# EAGLE design eTapper1main21 (EAGLE 8.2.2)
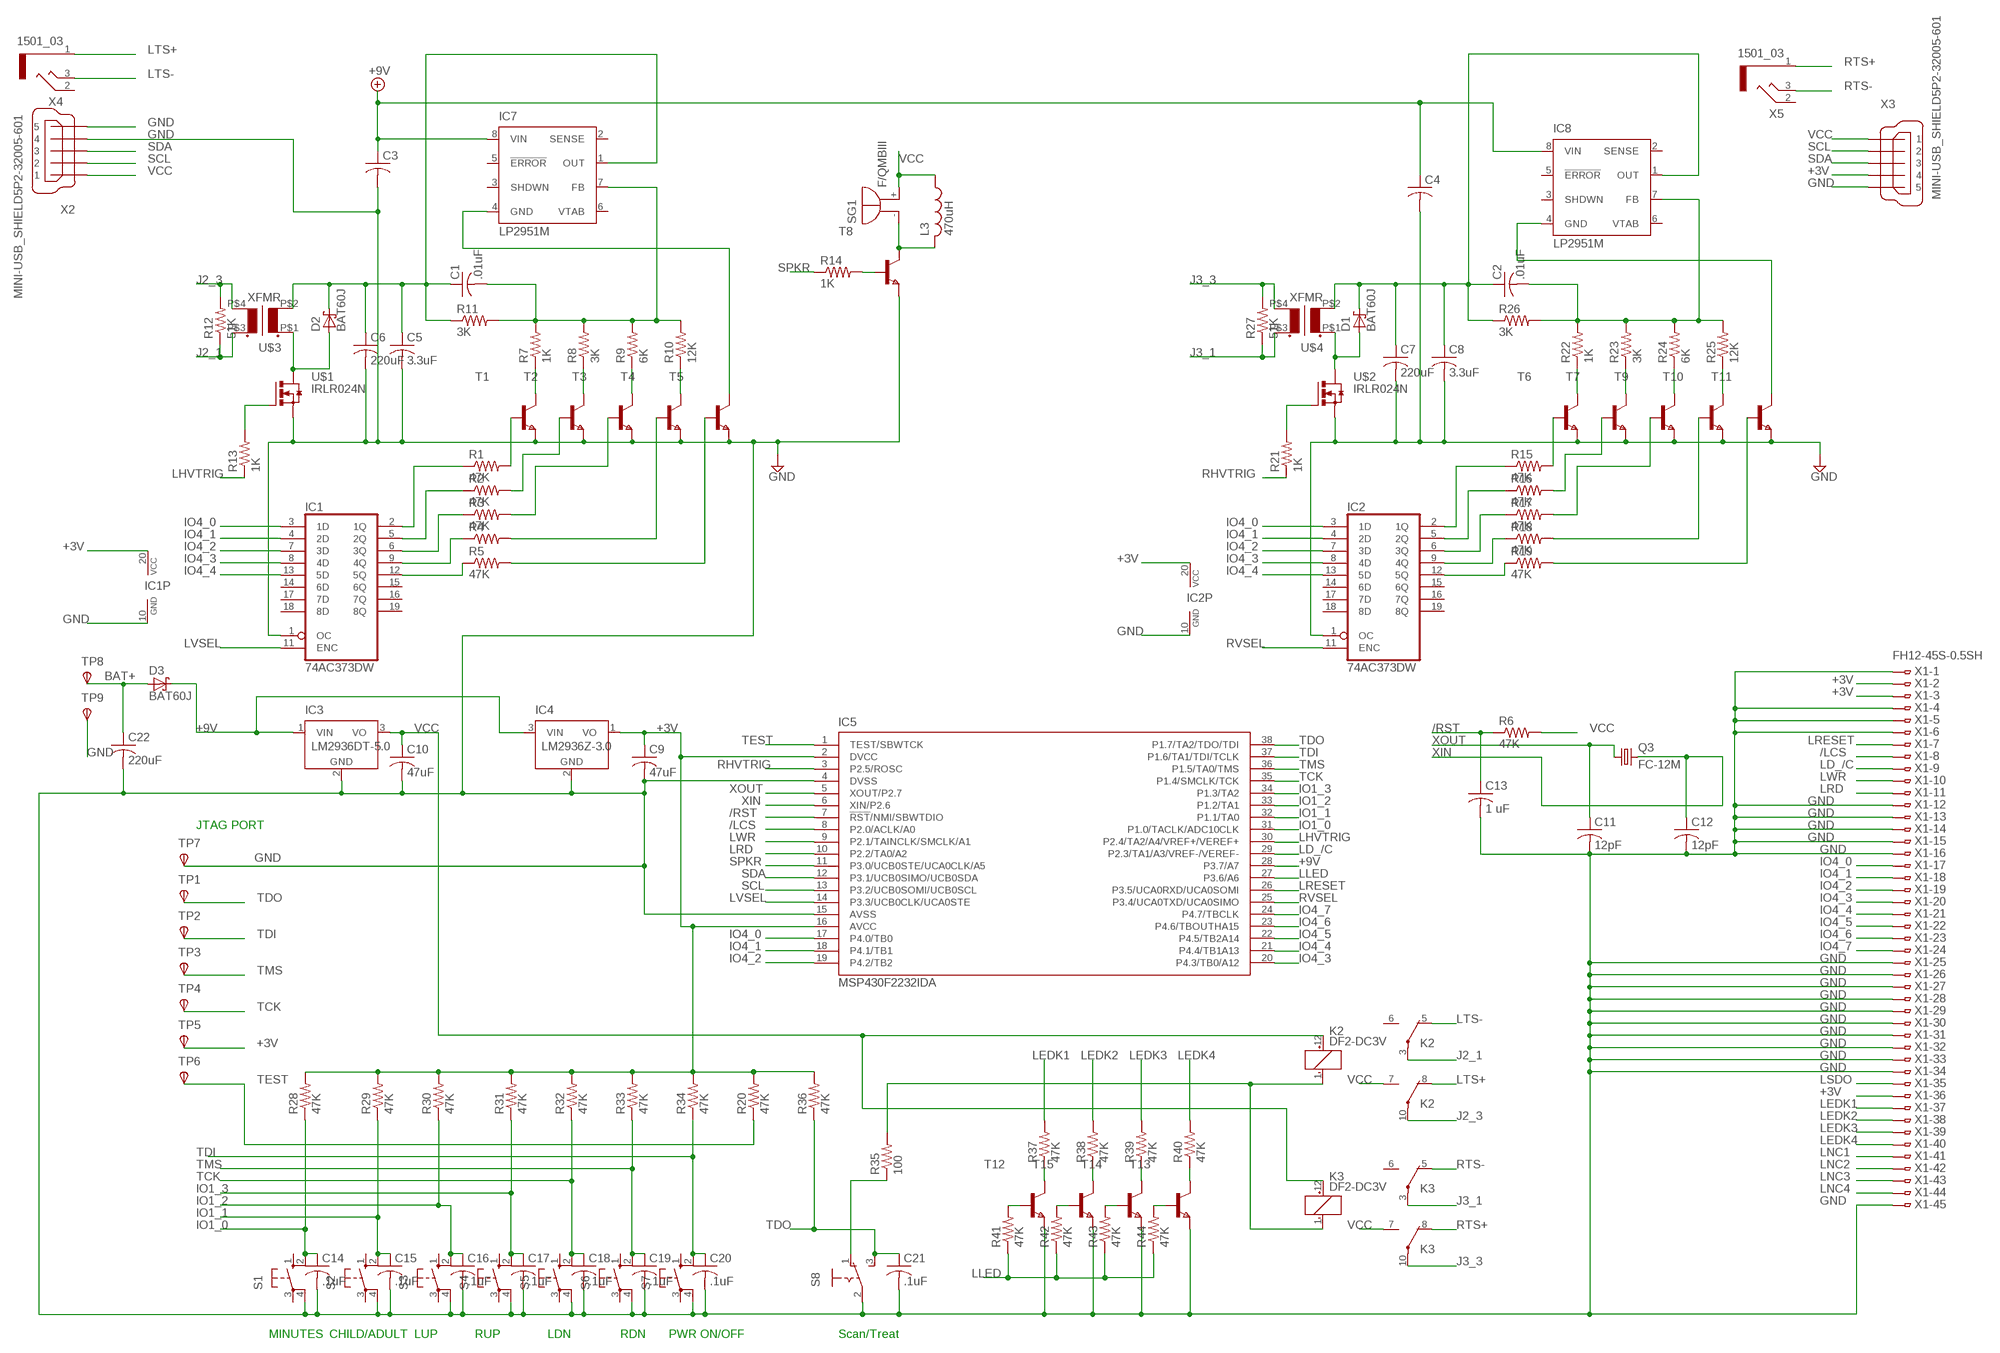
[diagram p0: schematic, sheet 1]

## Parts
C1  .01uF  C-USC0805  [C0805]
C2  .01uF  C-USC0805  [C0805]
C3  C-USC0805  [C0805]
C4  C-USC0805  [C0805]
C5  3.3uF  C-USC0805  [C0805]
C6  220uF  C-USC0805  [C0805]
C7  220uF  C-USC0805  [C0805]
C8  3.3uF  C-USC0805  [C0805]
C9  47uF  C-USC0805  [C0805]
C10  47uF  C-USC0805  [C0805]
C11  12pF  C-USC0805  [C0805]
C12  12pF  C-USC0805  [C0805]
C13  1 uF  C-USC0805  [C0805]
C14  .1uF  C-USC0805  [C0805]
C15  .1uF  C-USC0805  [C0805]
C16  .1uF  C-USC0805  [C0805]
C17  .1uF  C-USC0805  [C0805]
C18  .1uF  C-USC0805  [C0805]
C19  .1uF  C-USC0805  [C0805]
C20  .1uF  C-USC0805  [C0805]
C21  .1uF  C-USC0805  [C0805]
C22  220uF  C-USC0805  [C0805]
D1  BAT60J  [SOD323_ST]
D2  BAT60J  [SOD323_ST]
D3  BAT60J  [SOD323_ST]
IC1  74AC373DW  [SO20W]
IC2  74AC373DW  [SO20W]
IC3  LM2936DT-5.0  [TO252]
IC4  LM2936Z-3.0  [TO92]
IC5  MSP430F2232IDA  [TSSOP38_R-PDSO-G38-DA]
IC7  LP2951M  [SO08]
IC8  LP2951M  [SO08]
K2  DF2-DC3V  [DF2]
K3  DF2-DC3V  [DF2]
L3  470uH  L-USL2825P  [L2825P]
Q3  FC-12M  [FC-12M]
R1  47K  R-US_R0402  [R0402]
R2  47K  R-US_R0402  [R0402]
R3  47K  R-US_R0402  [R0402]
R4  R-US_R0402  [R0402]
R5  47K  R-US_R0402  [R0402]
R6  47K  R-US_R0402  [R0402]
R7  1K  R-US_R0402  [R0402]
R8  3K  R-US_R0402  [R0402]
R9  6K  R-US_R0402  [R0402]
R10  12K  R-US_R0402  [R0402]
R11  3K  R-US_R0402  [R0402]
R12  51K  R-US_R0402  [R0402]
R13  1K  R-US_R0402  [R0402]
R14  1K  R-US_R0402  [R0402]
R15  47K  R-US_R0402  [R0402]
R16  47K  R-US_R0402  [R0402]
R17  47K  R-US_R0402  [R0402]
R18  47K  R-US_R0402  [R0402]
R19  47K  R-US_R0402  [R0402]
R20  47K  R-US_R0402  [R0402]
R21  1K  R-US_R0402  [R0402]
R22  1K  R-US_R0402  [R0402]
R23  3K  R-US_R0402  [R0402]
R24  6K  R-US_R0402  [R0402]
R25  12K  R-US_R0402  [R0402]
R26  3K  R-US_R0402  [R0402]
R27  51K  R-US_R0402  [R0402]
R28  47K  R-US_R0402  [R0402]
R29  47K  R-US_R0402  [R0402]
R30  47K  R-US_R0402  [R0402]
R31  47K  R-US_R0402  [R0402]
R32  47K  R-US_R0402  [R0402]
R33  47K  R-US_R0402  [R0402]
R34  47K  R-US_R0402  [R0402]
R35  100  R-US_R0402  [R0402]
R36  47K  R-US_R0402  [R0402]
R37  47K  R-US_R0402  [R0402]
R38  47K  R-US_R0402  [R0402]
R39  47K  R-US_R0402  [R0402]
R40  47K  R-US_R0402  [R0402]
R41  47K  R-US_R0402  [R0402]
R42  47K  R-US_R0402  [R0402]
R43  47K  R-US_R0402  [R0402]
R44  47K  R-US_R0402  [R0402]
S1  10-XX  [B3F-10XX]
S2  10-XX  [B3F-10XX]
S3  10-XX  [B3F-10XX]
S4  10-XX  [B3F-10XX]
S5  10-XX  [B3F-10XX]
S6  10-XX  [B3F-10XX]
S7  10-XX  [B3F-10XX]
S8  M251  [M251]
SG1  F/QMBIII  [F/QMBIII]
T1  NPNSOT23  [SOT-23]
T2  NPNSOT23  [SOT-23]
T3  NPNSOT23  [SOT-23]
T4  NPNSOT23  [SOT-23]
T5  NPNSOT23  [SOT-23]
T6  NPNSOT23  [SOT-23]
T7  NPNSOT23  [SOT-23]
T8  NPNSOT23  [SOT-23]
T9  NPNSOT23  [SOT-23]
T10  NPNSOT23  [SOT-23]
T11  NPNSOT23  [SOT-23]
T12  NPNSOT23  [SOT-23]
T13  NPNSOT23  [SOT-23]
T14  NPNSOT23  [SOT-23]
T15  NPNSOT23  [SOT-23]
TP1  TPSTP06R  [TP06R]
TP2  TPSTP06R  [TP06R]
TP3  TPSTP06R  [TP06R]
TP4  TPSTP06R  [TP06R]
TP5  TPSTP06R  [TP06R]
TP6  TPSTP06R  [TP06R]
TP7  TPSTP06R  [TP06R]
TP8  TPSTP06R  [TP06R]
TP9  TPSTP06R  [TP06R]
U$1  IRLR024N  [I-PAK_TO251AA]
U$2  IRLR024N  [I-PAK_TO251AA]
U$3  XFMR  [XFMR]
U$4  XFMR  [XFMR]
X1  FH12-45S-0.5SH  [FH12-45S-0.5SH]
X2  MINI-USB_SHIELD5P2-32005-601  [32005-601]
X3  MINI-USB_SHIELD5P2-32005-601  [32005-601]
X4  1501_03  [1501_03]
X5  1501_03  [1501_03]

## Nets
+3V: C9.1 IC1.20(VCC) IC2.20(VCC) IC4.1(VO) IC5.2(DVCC) IC5.16(AVCC) R20.2 R28.2 R29.2 R30.2 R31.2 R32.2 R33.2 R34.2 R36.2 TP5.TP(PP) X1.2 X1.3 X1.36 X3.4
+9V: C3.1 C4.1 D3.C IC3.1(VIN) IC4.3(VIN) IC5.28(P3.7/A7) IC7.8(VIN) IC8.8(VIN)
/LCS: IC5.8(P2.0/ACLK/A0) X1.8
/RST: C13.1 IC5.7(!RST!/NMI/SBWTDIO) R6.1
BAT+: C22.1 D3.A TP8.TP(PP)
GND: C3.2 C4.2 C5.2 C6.2 C7.2 C8.2 C9.2 C10.2 C11.2 C12.2 C13.2 C14.2 C15.2 C16.2 C17.2 C18.2 C19.2 C20.2 C21.2 C22.2 IC1.1(OC) IC1.10(GND) IC2.1(OC) IC2.10(GND) IC3.2(GND) IC4.2(GND) IC5.4(DVSS) IC5.15(AVSS) S1.4(P1) S2.4(P1) S3.4(P1) S4.4(P1) S5.4(P1) S6.4(P1) S7.4(P1) S8.2(P) T1.2(E) T2.2(E) T3.2(E) T4.2(E) T5.2(E) T6.2(E) T7.2(E) T8.2(E) T9.2(E) T10.2(E) T11.2(E) T12.2(E) T13.2(E) T14.2(E) T15.2(E) TP7.TP(PP) TP9.TP(PP) U$1.3(S) U$2.3(S) X1.1 X1.4 X1.5 X1.6 X1.12 X1.13 X1.14 X1.15 X1.16 X1.25 X1.26 X1.27 X1.28 X1.29 X1.30 X1.31 X1.32 X1.33 X1.34 X1.45 X2.4 X2.5 X3.5
IO1_0: C14.1 IC5.31(P1.0/TACLK/ADC10CLK) R28.1 S1.2(S1)
IO1_1: C15.1 IC5.32(P1.1/TA0) R29.1 S2.2(S1)
IO1_2: C16.1 IC5.33(P1.2/TA1) R30.1 S3.2(S1)
IO1_3: C17.1 IC5.34(P1.3/TA2) R31.1 S4.2(S1)
IO4_0: IC1.3(1D) IC2.3(1D) IC5.17(P4.0/TB0) X1.17
IO4_1: IC1.4(2D) IC2.4(2D) IC5.18(P4.1/TB1) X1.18
IO4_2: IC1.7(3D) IC2.7(3D) IC5.19(P4.2/TB2) X1.19
IO4_3: IC1.8(4D) IC2.8(4D) IC5.20(P4.3/TB0/A12) X1.20
IO4_4: IC1.13(5D) IC2.13(5D) IC5.21(P4.4/TB1A13) X1.21
IO4_5: IC5.22(P4.5/TB2A14) X1.22
IO4_6: IC5.23(P4.6/TBOUTHA15) X1.23
IO4_7: IC5.24(P4.7/TBCLK) X1.24
J2_1: K2.3(2:P) R12.1 U$3.P$3(S1)
J2_3: K2.10(3:P) R12.2 U$3.P$4(S2)
J3_1: K3.3(2:P) R27.1 U$4.P$3(S1)
J3_3: K3.10(3:P) R27.2 U$4.P$4(S2)
LD_/C: IC5.29(P2.3/TA1/A3/VREF-/VEREF-) X1.9
LEDK1: R37.2 X1.37
LEDK2: R38.2 X1.38
LEDK3: R39.2 X1.39
LEDK4: R40.2 X1.40
LHVTRIG: IC5.30(P2.4/TA2/A4/VREF+/VEREF+) R13.1
LLED: IC5.27(P3.6/A6) R41.1 R42.1 R43.1 R44.1
LNC1: X1.41
LNC2: X1.42
LNC3: X1.43
LNC4: X1.44
LRD: IC5.10(P2.2/TA0/A2) X1.11
LRESET: IC5.26(P3.5/UCA0RXD/UCA0SOMI) X1.7
LSDO: X1.35
LTS+: K2.8(3:O) X4.1
LTS-: K2.5(2:O) X4.3
LVSEL: IC1.11(ENC) IC5.14(P3.3/UCB0CLK/UCA0STE)
LWR: IC5.9(P2.1/TAINCLK/SMCLK/A1) X1.10
N$1: IC1.2(1Q) R1.1
N$2: IC1.5(2Q) R2.1
N$3: IC1.6(3Q) R3.1
N$4: IC1.9(4Q) R4.1
N$5: IC1.12(5Q) R5.1
N$6: L3.2 SG1.-(+) T8.1(C)
N$7: R4.2 T4.3(B)
N$8: R5.2 T5.3(B)
N$9: D2.A U$1.2(D) U$1.4(D) U$3.P$1(P1)
N$10: R7.1 T1.1(C)
N$11: R8.1 T2.1(C)
N$12: R9.1 T3.1(C)
N$13: R1.2 T1.3(B)
N$14: R2.2 T2.3(B)
N$15: R3.2 T3.3(B)
N$16: R10.1 T4.1(C)
N$17: C1.2 IC7.7(FB) R7.2 R8.2 R9.2 R10.2 R11.2
N$18: C1.1 C5.1 C6.1 D2.C IC7.1(OUT) R11.1 U$3.P$2(P2)
N$19: D1.A U$2.2(D) U$2.4(D) U$4.P$1(P1)
N$20: IC2.2(1Q) R15.1
N$21: R13.2 U$1.1(G)
N$22: R14.2 T8.3(B)
N$23: R35.1 S8.1(O)
N$24: IC2.5(2Q) R16.1
N$25: IC2.6(3Q) R17.1
N$26: IC2.9(4Q) R18.1
N$27: IC2.12(5Q) R19.1
N$28: R44.2 T13.3(B)
N$29: R15.2 T6.3(B)
N$30: R16.2 T7.3(B)
N$31: R17.2 T9.3(B)
N$32: R18.2 T10.3(B)
N$33: R19.2 T11.3(B)
N$34: K2.1(1:-) K3.1(1:-) R35.2
N$35: R22.1 T6.1(C)
N$36: R23.1 T7.1(C)
N$37: R24.1 T9.1(C)
N$38: R25.1 T10.1(C)
N$39: C2.2 IC8.7(FB) R22.2 R23.2 R24.2 R25.2 R26.2
N$40: C2.1 C7.1 C8.1 D1.C IC8.1(OUT) R26.1 U$4.P$2(P2)
N$41: R37.1 T12.1(C)
N$42: R21.2 U$2.1(G)
N$43: R38.1 T15.1(C)
N$44: R39.1 T14.1(C)
N$45: IC7.4(GND) T5.1(C)
N$46: R40.1 T13.1(C)
N$47: IC8.4(GND) T11.1(C)
N$48: R43.2 T14.3(B)
N$49: R41.2 T12.3(B)
N$50: R42.2 T15.3(B)
RHVTRIG: IC5.3(P2.5/ROSC) R21.1
RTS+: K3.8(3:O) X5.1
RTS-: K3.5(2:O) X5.3
RVSEL: IC2.11(ENC) IC5.25(P3.4/UCA0TXD/UCA0SIMO)
SCL: IC5.13(P3.2/UCB0SOMI/UCB0SCL) X2.2 X3.2
SDA: IC5.12(P3.1/UCB0SIMO/UCB0SDA) X2.3 X3.3
SPKR: IC5.11(P3.0/UCB0STE/UCA0CLK/A5) R14.1
TCK: C18.1 IC5.35(P1.4/SMCLK/TCK) R32.1 S5.2(S1) TP4.TP(PP)
TDI: C20.1 IC5.37(P1.6/TA1/TDI/TCLK) R34.1 S7.2(S1) TP2.TP(PP)
TDO: C21.1 IC5.38(P1.7/TA2/TDO/TDI) R36.1 S8.3(S) TP1.TP(PP)
TEST: IC5.1(TEST/SBWTCK) R20.1 TP6.TP(PP)
TMS: C19.1 IC5.36(P1.5/TA0/TMS) R33.1 S6.2(S1) TP3.TP(PP)
VCC: C10.1 IC3.3(VO) K2.7(3:S) K2.12(1:+) K3.7(3:S) K3.12(1:+) L3.1 R6.2 SG1.+(-) X2.1 X3.1
XIN: C12.1 IC5.6(XIN/P2.6) Q3.2
XOUT: C11.1 IC5.5(XOUT/P2.7) Q3.1
Unconnected: IC1.14(6D) IC1.15(6Q) IC1.16(7Q) IC1.17(7D) IC1.18(8D) IC1.19(8Q) IC2.14(6D) IC2.15(6Q) IC2.16(7Q) IC2.17(7D) IC2.18(8D) IC2.19(8Q) IC7.2(SENSE) IC7.3(SHDWN) IC7.5(!ERROR) IC7.6(VTAB) IC8.2(SENSE) IC8.3(SHDWN) IC8.5(!ERROR) IC8.6(VTAB) K2.6(2:S) K3.6(2:S) S1.1(S) S1.3(P) S2.1(S) S2.3(P) S3.1(S) S3.3(P) S4.1(S) S4.3(P) S5.1(S) S5.3(P) S6.1(S) S6.3(P) S7.1(S) S7.3(P) X2.M1(S1) X2.M2(S2) X3.M1(S1) X3.M2(S2) X4.2 X5.2

## Notes on the sheet
- JTAG PORT
- MINUTES | CHILD/ADULT | LUP | RUP | LDN | RDN | PWR ON/OFF | Scan/Treat

## Library data of the parts
C1-C22 = rcl:C-US: CAPACITOR, American symbol
D1-D3 = diode:BAT60J: Schottky barrier diode Source: www.st.com, BAT60J.pdf
IC1 IC2 = 74xx-eu:74*373: Octal D type transparent LATCH, edge triggered
IC3 = national-semiconductor:LM2936?*: Ultra-Low Quiescent Current LDO Voltage Regulator Source: Data sheet <http://www.national.com/ds/LM/LM2936.pdf>; MF: NATIONAL SEMICONDUCTOR; MPN: LM2936DT-5.0/NOPB; OC_FARNELL: 1286864; OC_NEWARK: 41K4501
IC4 = national-semiconductor:LM2936?*: Ultra-Low Quiescent Current LDO Voltage Regulator Source: Data sheet <http://www.national.com/ds/LM/LM2936.pdf>; MF: NATIONAL SEMICONDUCTOR; MPN: LM2936Z-3.0/NOPB; OC_FARNELL: 1312709; OC_NEWARK: 41K4531
IC5 = texas:MSP430F22*2IDA: MIXED SIGNAL MICROCONTROLLER Source: http://focus.ti.com/lit/ds/symlink/msp430f2274.pdf; MPN: MSP430F2232IDA; OC_FARNELL: 1610178; OC_NEWARK: 28M6312
IC7 IC8 = national-semiconductor:LP2951: Adjustable Micropower Voltage Regulator Source: http://www.national.com/ds/LP/LP2950.pdf; MF: FAIRCHILD SEMICONDUCTOR; MPN: LP2951CM; OC_FARNELL: 9488561; OC_NEWARK: 78K6014
K2 K3 = relay:DF2-?DC*: HIGHLY SENSITIVE DIP MINIATURE RELAY NAiS Single side stable / 1 coil latching Source: http://www.mew-europe.com/.. en_ds_61002_0000.pdf; OC_FARNELL: unknown; OC_NEWARK: unknown
L3 = rcl:L-US: INDUCTOR, American symbol
Q3 = crystal:FC-12M: kHz RANGE CRYSTAL UNIT LOW PROFILE SMD Source: Epson Toyocom FC-12M.pdf
R1-R44 = resistor:R-US_: RESISTOR, American symbol
S1-S7 = switch-omron:10-XX: OMRON SWITCH; MPN: B3F-1000; OC_FARNELL: 176432; OC_NEWARK: 36M3542
S8 = switch:M251: SLIDING SWITCH Mors, distributor Buerklin, 11G702
SG1 = buzzer:F/QMBIII: BUZZER Source: Buerklin; OC_FARNELL: unknown; OC_NEWARK: unknown
T1-T15 = zetex:NPNSOT23: NPN TRANSISTOR; MPN: DSS20201L-7; OC_FARNELL: 1710688; OC_NEWARK: 25R4555
TP1-TP9 = testpad:TPS: TEST PIN
U$1 U$2 = IRLR024N:IRLR024N: IRLR024N HEXFET Power Mosfet N channel Infeneon Technology TO-251AA IPAK
U$3 U$4 = XFMR:XFMR: Transformer 1"X1" 0.4"X0.4" hole separation for e_tapper
X1 = con-hirose:FH12-45S-0.5S: 0.5mm Pitch Connectors For FPC/FFC Source: Data sheet <http://www.hirose.co.jp/cataloge_hp/e58605370.pdf>; OC_FARNELL: unknown; OC_NEWARK: unknown
X2 X3 = con-cypressindustries:MINI-USB_SHIELD5P2-: MINI USB-B R/A DIP 5pol. Source: www.cypressindustries.com; OC_FARNELL: unknown; OC_NEWARK: unknown
X4 X5 = con-lumberg:1501_03: Klinkensteckverbinder nach JISC 6560, 2,5 mm Jack connectors according to JISC 6560, 2.5 mm Source: http://www.lumberg.com/Produkte/PDFs/1501_03.pdf; OC_FARNELL: 1200127; OC_NEWARK: unknown

## Module LP2951
Ports: 

### Library data of the parts

## Board
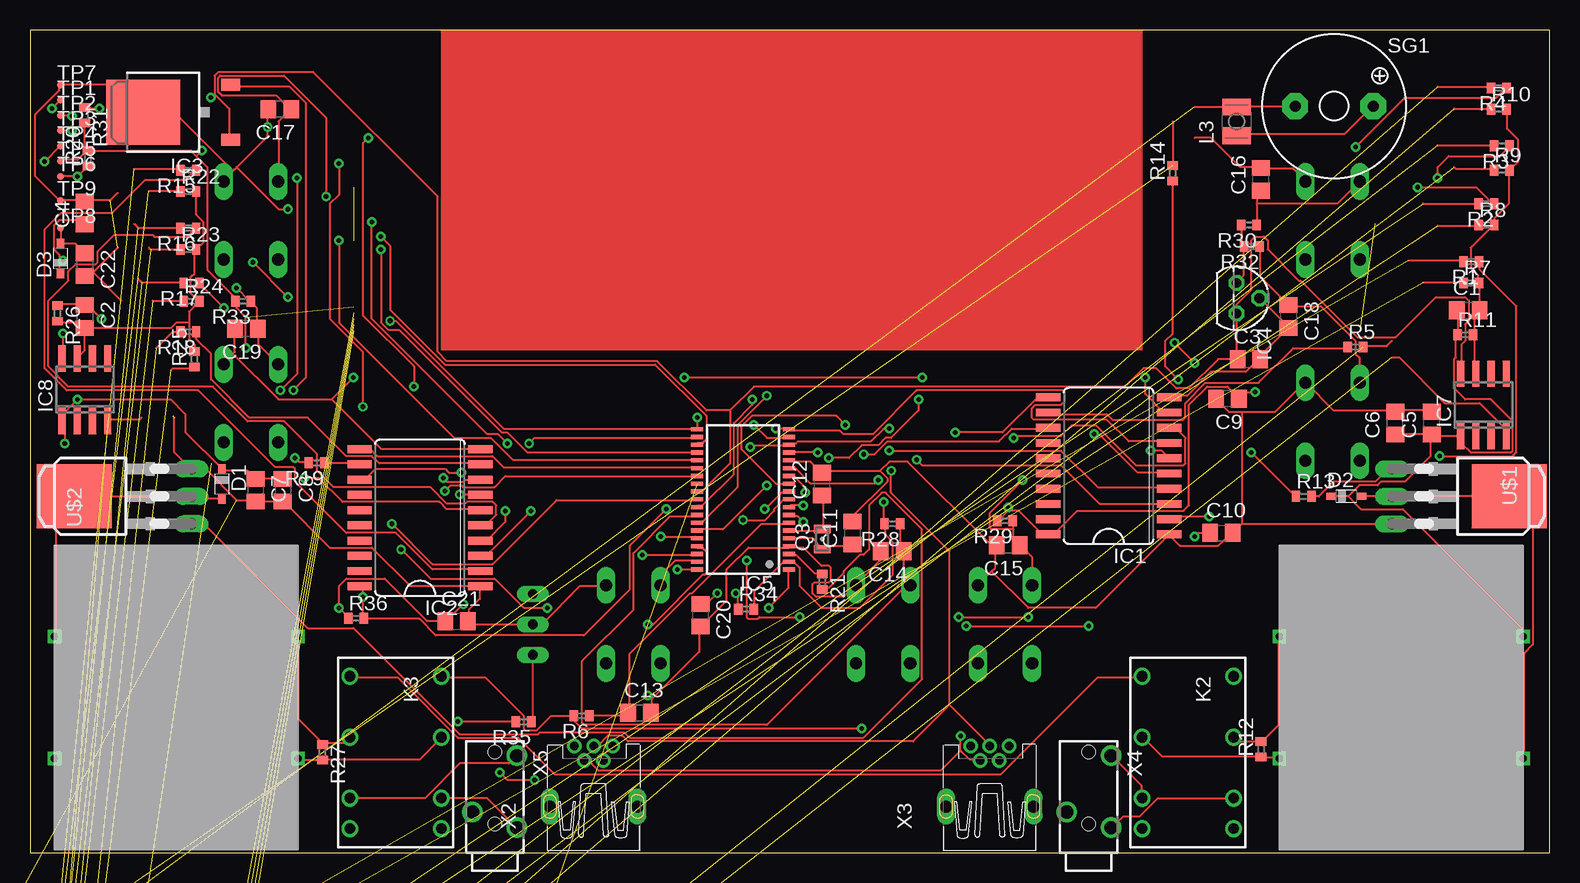
[diagram p1: board, top side]
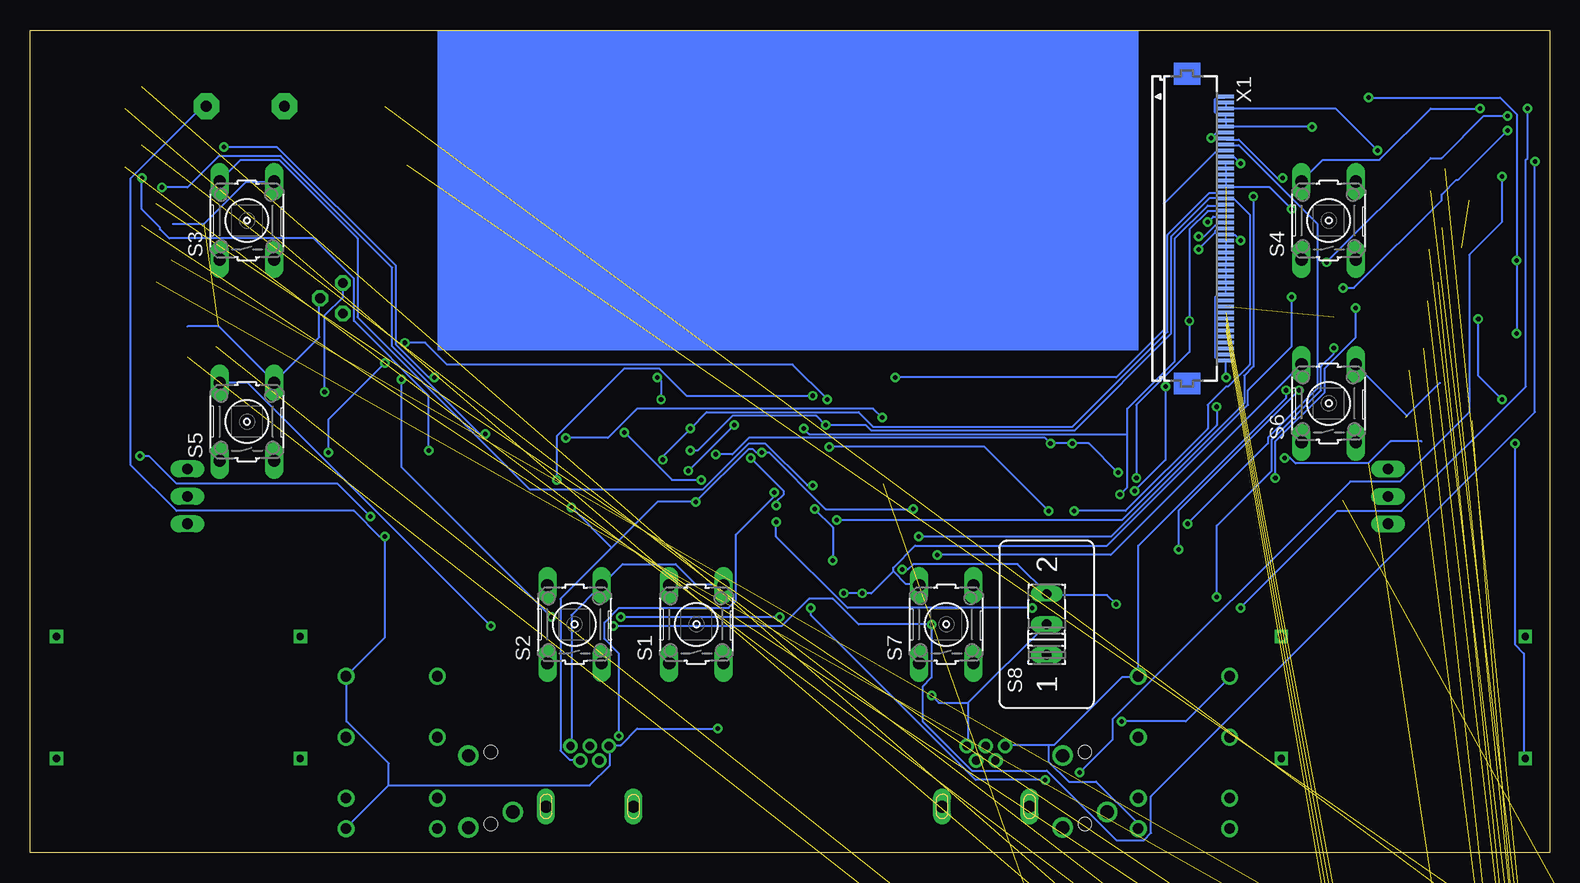
[diagram p2: board, bottom side, seen from below]

Size 126.67 x 68.57 mm. Coordinates in mm from the lower left corner, seen from the top.
Outline: 0,0 126.67,0 126.67,68.57 0,68.57 0,0
Copper layers (1*16): Top 0.035mm / dielectric 1.5mm / Bottom 0.035mm
Design rules "default *": minimum track width 6mil, minimum drill 15mil, track to track 6mil, track to pad 6mil, pad to pad 6mil, via to via 6mil, smd to smd 6mil, copper to edge 10mil, drill to drill 10mil, minimum pad ring 10mil, minimum via ring 8mil, stop-mask expansion 4mil, vias tented up to drill 0mil, thermal gap 15mil

### Footprints (pad centres in the part's own frame; a part is rotated, then mirrored left to right if it is on the bottom)
C0805 = smd 1.3 x 1.5: 1 -0.95,0; 2 0.95,0
SOD323_ST = smd 0.8 x 0.6: A 1.25,0; C -1.25,0
SO20W = smd 0.66 x 2.032: 1 -5.715,-5.029; 2 -4.445,-5.029; 3 -3.175,-5.029; 4 -1.905,-5.029; 5 -0.635,-5.029; 6 0.635,-5.029; 7 1.905,-5.029; 8 3.175,-5.029; 9 4.445,-5.029; 10 5.715,-5.029; 11 5.715,5.029; 12 4.445,5.029; 13 3.175,5.029; 14 1.905,5.029; 15 0.635,5.029; 16 -0.635,5.029; 17 -1.905,5.029; 18 -3.175,5.029; 19 -4.445,5.029; 20 -5.715,5.029
TO252 = smd 1 x 1.6: 1 -2.28,-4.8; 3 2.28,-4.8 | smd 5.4 x 6.2: 2 0,2.5
TO92 = drill 0.813 pad 1.27 octagon: 1 -1.27,0; 2 0,1.905; 3 1.27,0
TSSOP38_R-PDSO-G38-DA = smd 0.35 x 1: 1 -5.85,-3.85; 2 -5.2,-3.85; 3 -4.55,-3.85; 4 -3.9,-3.85; 5 -3.25,-3.85; 6 -2.6,-3.85; 7 -1.95,-3.85; 8 -1.3,-3.85; 9 -0.65,-3.85; 10 0,-3.85; 11 0.65,-3.85; 12 1.3,-3.85; 13 1.95,-3.85; 14 2.6,-3.85; 15 3.25,-3.85; 16 3.9,-3.85; 17 4.55,-3.85; 18 5.2,-3.85; 19 5.85,-3.85; 20 5.85,3.85; 21 5.2,3.85; 22 4.55,3.85; 23 3.9,3.85; 24 3.25,3.85; 25 2.6,3.85; 26 1.95,3.85; 27 1.3,3.85; 28 0.65,3.85; 29 0,3.85; 30 -0.65,3.85; 31 -1.3,3.85; 32 -1.95,3.85; 33 -2.6,3.85; 34 -3.25,3.85; 35 -3.9,3.85; 36 -4.55,3.85; 37 -5.2,3.85; 38 -5.85,3.85
SO08 = smd 0.6 x 2.2: 1 -1.905,-2.6; 2 -0.635,-2.6; 3 0.635,-2.6; 4 1.905,-2.6; 5 1.905,2.6; 6 0.635,2.6; 7 -0.635,2.6; 8 -1.905,2.6
DF2 = drill 0.9: 1 -6.35,-3.81; 3 -1.27,-3.81; 5 3.81,-3.81; 6 6.35,-3.81; 7 6.35,3.81; 8 3.81,3.81; 10 -1.27,3.81; 12 -6.35,3.81
L2825P = smd 1.4 x 2.4: 1 -1.2,0; 2 1.2,0
FC-12M = smd 0.7 x 1.4: 1 -0.85,0; 2 0.85,0
R0402 = smd 0.7 x 0.9: 1 -0.65,0; 2 0.65,0
B3F-10XX = drill 1.016 long: 1 -3.251,2.261; 2 3.251,2.261; 3 -3.251,-2.261; 4 3.251,-2.261
M251 = drill 0.813 long: 1 -2.54,0; 2 0,0; 3 2.54,0
F/QMBIII = drill 0.914 pad 2.159 octagon: + 3.251,0; - -3.251,0
SOT-23 = smd 0.787 x 0.889: 1 0.025,-1.016; 2 -0.94,1.016; 3 0.991,1.016
TP06R = smd 0.6 x 0.6: TP 0,0
I-PAK_TO251AA = drill 0.889 long: 1 -2.286,-5.334; 2 0,-5.334; 3 2.286,-5.334 | smd 5.334 x 6.223: 4 0,4.445
XFMR = drill 0.6 square: P$1 -10.16,5.08; P$2 -10.16,-5.08; P$3 10.16,5.08; P$4 10.16,-5.08
FH12-45S-0.5SH = smd 0.3 x 1.3: 1 -13,3.25; 2 -12.5,3.25; 3 -12,3.25; 4 -11.5,3.25; 5 -11,3.25; 6 -10.5,3.25; 7 -10,3.25; 8 -9.5,3.25; 9 -9,3.25; 10 -8.5,3.25; 11 -8,3.25; 12 -7.5,3.25; 13 -7,3.25; 14 -6.5,3.25; 15 -6,3.25; 16 -5.5,3.25; 17 -5,3.25; 18 -4.5,3.25; 19 -4,3.25; 20 -3.5,3.25; 21 -3,3.25; 22 -2.5,3.25; 23 -2,3.25; 24 -1.5,3.25; 25 -1,3.25; 26 -0.5,3.25; 27 0,3.25; 28 0.5,3.25; 29 1,3.25; 30 1.5,3.25; 31 2,3.25; 32 2.5,3.25; 33 3,3.25; 34 3.5,3.25; 35 4,3.25; 36 4.5,3.25; 37 5,3.25; 38 5.5,3.25; 39 6,3.25; 40 6.5,3.25; 41 7,3.25; 42 7.5,3.25; 43 8,3.25; 44 8.5,3.25; 45 9,3.25
32005-601 = drill 0.7 pad 1.016: 1 2.825,1.6; 2 1.625,0.8; 3 2.825,0; 4 1.625,-0.8; 5 2.825,-1.6 | drill 1 pad 1.422 long: M1 -2.225,3.65; M2 -2.225,-3.65
1501_03 = drill 1.1 pad 1.7: 1 -1.85,0.3; 2 1.85,-1; 3 -1.85,-5.7 | hole 1.1: 0,0; 0,-6

### Placement (x,y rotation side)
C1  119.89,45.21 0 top
C2  4.57,44.7 270 top
C3  101.6,41.15 0 top
C4  4.57,53.34 90 top
C5  116.84,35.81 90 top
C6  113.79,35.81 90 top
C7  18.8,30.23 270 top
C8  21.08,30.23 270 top
C9  99.82,37.85 180 top
C10  99.31,26.67 0 top
C11  68.58,26.67 90 top
C12  66.04,30.73 90 top
C13  50.8,11.68 0 top
C14  71.88,25.15 180 top
C15  81.53,25.65 180 top
C16  102.62,56.13 90 top
C17  20.83,61.98 180 top
C18  104.9,44.7 270 top
C19  18.03,43.69 180 top
C20  55.88,19.81 270 top
C21  35.56,19.3 0 top
C22  4.57,49.02 270 top
D1  16,30.73 270 top
D2  109.73,29.72 0 top
D3  2.54,49.53 90 top
IC1  89.92,32.26 90 top
IC2  32.51,27.94 90 top
IC3  11.94,61.72 90 top
IC4  100.58,46.23 270 top
IC5  59.44,29.46 90 top
IC7  121.16,37.34 0 top
IC8  4.57,38.61 0 top
K2  96.52,8.38 270 top
K3  30.48,8.38 270 top
L3  100.58,60.96 90 top
Q3  66.04,26.16 90 top
R1  120.14,49.28 180 top
R2  121.41,54.1 180 top
R3  122.68,58.93 180 top
R4  122.43,63.75 180 top
R5  110.49,42.16 0 top
R6  45.97,11.43 180 top
R7  120.14,47.5 0 top
R8  121.41,52.32 0 top
R9  122.68,56.9 0 top
R10  122.43,61.98 0 top
R11  119.63,43.18 0 top
R12  102.62,8.64 90 top
R13  106.17,29.72 0 top
R14  95.25,56.64 90 top
R15  13.21,56.9 180 top
R16  13.21,52.07 180 top
R17  13.46,47.5 180 top
R18  13.21,43.43 180 top
R19  23.88,32.51 180 top
R20  4.83,57.91 90 top
R21  66.04,22.61 270 top
R22  13.21,55.12 0 top
R23  13.21,50.29 0 top
R24  13.46,45.97 0 top
R25  13.72,41.15 90 top
R26  2.29,44.96 270 top
R27  24.38,8.38 270 top
R28  71.88,27.43 180 top
R29  81.28,27.69 180 top
R30  101.6,52.32 180 top
R31  4.57,61.47 270 top
R32  101.85,50.55 180 top
R33  17.78,45.97 180 top
R34  59.69,20.32 0 top
R35  41.15,10.92 180 top
R36  27.18,19.56 0 top
R37  -5.08,-123.19 0 top  (outside the outline)
R38  -5.08,-128.27 0 top  (outside the outline)
R39  -5.08,-133.35 0 top  (outside the outline)
R40  -5.08,-138.43 0 top  (outside the outline)
R41  -5.08,-143.51 0 top  (outside the outline)
R42  -5.08,-148.59 0 top  (outside the outline)
R43  -5.08,-153.67 0 top  (outside the outline)
R44  -5.08,-158.75 0 top  (outside the outline)
S1  71.12,19.05 90 bottom
S2  81.28,19.05 90 bottom
S3  108.58,52.7 90 bottom
S4  18.41,52.7 90 bottom
S5  108.58,35.94 90 bottom
S6  18.41,37.47 90 bottom
S7  50.29,19.05 90 bottom
S8  41.91,19.05 90 bottom
SG1  108.71,62.23 0 top
T1  -3.81,-19.05 0 top  (outside the outline)
T2  -3.81,-26.67 0 top  (outside the outline)
T3  -3.81,-34.29 0 top  (outside the outline)
T4  -3.81,-41.91 0 top  (outside the outline)
T5  -3.81,-49.53 0 top  (outside the outline)
T6  -3.81,-57.15 0 top  (outside the outline)
T7  -3.81,-64.77 0 top  (outside the outline)
T8  -3.81,-11.43 0 top  (outside the outline)
T9  -3.81,-72.39 0 top  (outside the outline)
T10  -3.81,-80.01 0 top  (outside the outline)
T11  -3.81,-87.63 0 top  (outside the outline)
T12  -3.81,-95.25 0 top  (outside the outline)
T13  -3.81,-102.87 0 top  (outside the outline)
T14  -3.81,-110.49 0 top  (outside the outline)
T15  -3.81,-118.11 0 top  (outside the outline)
TP1  2.54,62.74 0 top
TP2  2.54,61.47 0 top
TP3  2.54,60.2 0 top
TP4  2.54,58.93 0 top
TP5  2.54,57.66 0 top
TP6  2.54,56.39 0 top
TP7  2.54,64.01 0 top
TP8  2.54,52.07 0 top
TP9  2.54,54.36 0 top
U$1  118.87,29.72 270 top
U$2  8.13,29.72 90 top
U$3  114.3,12.95 180 top
U$4  12.19,12.95 0 top
X1  30.23,50.04 270 bottom
X2  46.99,6.1 90 top
X3  80.01,6.1 90 top
X4  88.27,2.41 180 top
X5  38.73,2.41 180 top

### Tracks (layer width: path | path; a pad name or v marks a point on that pad's centre or on a via)
+3V  (via drill 0.38)  (1 unrouted)
  Top 0.152: R30.2 101.04,52.27 101.04,50.75 101.19,50.6 R32.2 101.19,50.44 101.19,48.16 100.58,47.55 IC4.1 | 81.53,28.5 80.77,27.74 R29.2 | 81.53,28.5 82.45,28.5 84.28,26.67 84.89,26.67 | 84.89,26.67 85.5,26.67 87.33,28.5 96.16,28.5 96.62,28.96 96.62,37.34 98.15,38.86 99.82,38.86 100.74,37.95 C9.1 100.89,37.95 101.35,38.41 v102.11,38.41 | 84.89,26.67 IC1.20 | TP5.TP 2.59,57.76 3.96,57.76 4.72,58.52 R20.2 | 13.87,58.06 13.41,58.52 4.88,58.52 R20.2 | 13.87,58.06 14.78,57.15 14.78,48.62 17.07,46.33 17.07,46.02 R33.2 17.22,45.87 17.22,45.41 17.98,44.65 v17.98,42.06 | R31.2 4.57,58.83 4.72,58.67 R20.2 | 13.87,58.06 v14.33,58.52 | IC2.20 27.58,22.1 27.74,21.95 v27.74,21.34 27.74,19.66 R36.2 27.89,19.51 32.46,19.51 33.83,18.14 46.18,18.14 49.99,21.95 49.99,25.6 v53.03,28.65 | R34.2 60.35,20.42 60.35,21.79 62.79,24.23 63.25,24.23 IC5.2 63.4,24.23 63.7,24.23 64.16,23.77 64.16,22.25 65.99,20.42 69.19,20.42 71.93,23.16 71.93,25.91 71.32,26.52 71.32,27.43 R28.2 71.17,27.43 v71.17,29.26 | v65.68,33.38 63.4,33.38 IC5.16 | v81.53,28.8 81.53,28.5
  Bottom 0.152: IC4.1 100.58,46.33 102.11,44.81 v102.11,38.41 | X1.2 26.98,62.48 26.98,62.18 X1.3 26.98,62.03 17.83,62.03 v14.33,58.52 | 78.18,25.45 74.37,29.26 v71.17,29.26 66.75,33.68 66.45,33.68 66.14,33.38 v65.68,33.38 65.08,33.38 60.35,28.65 v53.03,28.65 | 78.18,25.45 82.45,21.18 82.45,8.53 81.69,7.77 80.92,7.77 X3.4 | v17.98,42.06 17.98,41.6 19.05,40.54 19.05,38.56 23.16,34.44 23.16,31.85 27.74,27.28 v27.74,21.34 | 78.18,25.45 v81.53,28.8
+9V  (via drill 0.38)
  Top 0.152: IC7.8 119.33,40.08 119.33,42.37 119.63,42.67 119.63,44.04 119.94,44.35 119.94,46.02 119.63,46.33 117.2,46.33 113.84,42.98 110.64,42.98 105.92,47.7 105.77,47.7 103.17,50.29 103.17,51.05 102.87,51.36 102.11,51.36 101.8,51.05 101.8,46.94 100.58,45.72 IC4.3 100.58,41.15 | 2.44,49.38 2.44,49.84 1.98,50.29 1.98,52.27 2.44,52.73 4.27,52.73 4.57,52.43 C4.1 | 2.44,49.38 2.44,48.31 D3.C | v2.74,43.28 2.74,41.3 IC8.8 | 2.44,49.38 v2.74,49.38 | 58.37,36.88 58.37,32.46 56.08,30.18 55.63,30.18 IC5.28 | 58.37,36.88 60.35,38.86 91.29,38.86 92.81,40.39 93.88,40.39 95.56,38.71 96.62,38.71 99.06,41.15 100.58,41.15 | 15.39,63.25 16.61,62.03 16.61,59.59 IC3.1 | 15.39,63.25 15.39,64.77 15.7,65.08 23.62,65.08 33.98,54.71 33.98,41.76 34.75,41 52.27,41 56.39,36.88 58.37,36.88 | 15.39,63.25 v15.09,62.94 | 100.58,41.15 C3.1
  Bottom 0.152: v2.74,43.28 v2.74,49.38 2.74,61.57 4.12,62.94 v15.09,62.94
/LCS  (via drill 0.38)
  Top 0.152: v64.47,27.58 64.01,28.04 63.4,28.04 IC5.8 | v43.13,20.42 41.15,20.42 38.71,22.86 33.38,22.86 v30.94,25.3 | v20.88,38.56 22.25,39.93 v22.25,56.24
  Bottom 0.152: v64.47,27.58 64.47,26.36 58.52,20.42 v43.13,20.42 | v30.94,25.3 30.94,28.5 v20.88,38.56 | v22.25,56.24 22.71,56.24 25.91,59.44 26.98,59.44 X1.8
/RST
  Top 0.152: R6.1 49.68,11.43 49.84,11.58 C13.1 49.99,11.73 49.99,16.61 55.02,21.64 55.17,21.64 60.96,27.43 63.25,27.43 IC5.7
BAT+
  Top 0.152: TP8.TP 2.59,51.97 2.59,50.9 D3.A 2.59,50.75 3.81,50.75 4.57,49.99 C22.1
GND  (via drill 0.38)  (19 unrouted)
  Top 0.152: 16.92,41.6 16.15,40.84 S6.4 | 16.92,41.6 17.07,41.76 17.07,43.59 C19.2 | 25.15,37.8 29.26,33.68 37.49,33.68 IC2.10 | 25.15,37.8 20.73,37.8 16.92,41.6 | 25.15,37.8 v26.98,39.62 | 16.92,56.84 16.15,56.08 S4.4 | 16.92,56.84 17.22,57.15 | 17.22,57.15 19.81,59.74 v19.81,60.5 19.81,61.87 C17.2 | v21.49,53.65 20.73,53.65 17.22,57.15 | 16.92,56.84 12.04,61.72 IC3.2 9.3,61.72 7.01,64.01 TP7.TP 2.44,64.01 2.44,63.55 0.46,61.57 0.46,56.39 2.44,54.41 TP9.TP 2.59,54.41 4.57,54.41 | X2.4 47.85,7.77 47.85,8.23 48.46,8.84 X2.5 | S7.4 48.01,22.25 45.87,22.25 42.67,19.05 S8.2 36.73,19.05 36.58,19.2 C21.2 36.58,19.36 36.58,20.27 37.49,21.18 37.49,22.1 IC2.1 37.49,22.25 31.7,22.25 28.5,25.45 24.99,25.45 21.18,29.26 C8.2 21.03,29.26 18.9,29.26 C7.2 18.75,29.41 17.22,29.41 14.63,32 U$2.3 13.41,32 12.04,33.38 12.04,36.27 | 4.57,54.41 6.71,54.41 7.32,55.02 | 4.57,54.41 C4.2 | 7.32,50.44 5.18,48.31 | 5.18,48.31 5.03,48.16 4.57,48.16 C22.2 5.18,48.31 | 7.62,46.02 5.33,48.31 5.18,48.31 | 51.82,12.8 51.82,11.73 C13.2 | 51.82,12.8 55.78,16.76 55.78,18.75 C20.2 55.93,18.9 58.06,21.03 58.06,23.62 59.89,25.45 63.25,25.45 IC5.4 63.4,25.45 64.47,25.45 65.99,23.93 66.6,23.93 66.75,23.77 66.75,22.71 66.6,22.55 65.38,22.55 65.23,22.4 65.23,21.64 65.53,21.34 67.82,21.34 68.73,22.25 S1.4 68.89,22.4 70.87,24.38 70.87,25.15 C14.2 | IC5.15 63.4,32.61 65.08,32.61 65.99,31.7 C12.2 66.14,31.7 66.29,31.85 70.87,31.85 | C11.2 68.58,28.04 71.48,30.94 71.48,31.24 70.87,31.85 | 80.16,23.47 79.1,22.4 S2.4 | 80.16,23.47 80.47,23.77 80.47,25.6 C15.2 80.47,25.76 80.01,25.76 73.15,32.61 71.63,32.61 70.87,31.85
  Top 0.152: S3.4 106.22,56.08 105.31,57 102.72,57 C16.2 102.56,57.15 100.89,57.15 98.45,59.59 97.08,59.59 | 94.94,26.52 95.86,25.6 99.06,25.6 100.13,26.67 C10.2 100.28,26.67 101.04,27.43 | 101.04,27.43 U$1.3 | IC1.10 94.94,38.1 96.47,38.1 98.45,40.08 101.35,40.08 102.41,41.15 C3.2 102.56,41.15 102.56,41.45 104.85,43.74 C18.2 104.85,43.89 102.56,46.18 IC4.2 | C5.2 116.74,36.88 113.84,36.88 C6.2 113.69,36.88 108.66,36.88 106.38,39.17 S5.4 106.22,39.17 103.78,36.73 101.04,36.73 | 101.04,36.73 99.97,36.73 98.91,37.8 C9.2 | 101.04,36.73 101.04,27.43 | 80.16,23.47 83.21,20.42 88.85,20.42 94.94,26.52 | 94.94,26.52 IC1.1 | 51.82,12.8 v51.51,13.11
  Bottom 0.152: X1.25 26.98,50.9 26.98,50.6 X1.26 26.98,50.44 26.98,50.14 X1.27 26.98,49.99 26.98,49.68 X1.28 26.98,49.07 X1.29 26.98,48.92 26.98,48.62 X1.30 26.98,48.46 26.98,48.16 X1.31 26.98,48.01 X1.32 26.98,47.4 26.98,47.09 X1.33 26.98,46.94 26.98,46.63 X1.34 27.13,46.48 27.74,46.48 27.89,46.33 27.89,41.3 27.74,41.15 27.13,41.15 X1.45 26.98,41 v26.98,39.62 | X1.1 27.13,62.94 27.74,62.94 27.89,62.79 27.89,61.72 27.74,61.57 27.13,61.57 X1.4 26.98,61.42 26.98,61.11 X1.5 26.98,60.96 26.98,60.66 X1.6 26.98,60.5 v19.81,60.5 | X1.14 26.98,57 X1.13 26.98,57.15 26.98,57.45 X1.12 | X1.14 26.98,56.08 X1.15 26.98,55.93 26.98,55.63 X1.16 26.98,55.47 23.32,55.47 v21.49,53.65 | X1.14 | 48.46,12.5 48.46,8.99 X2.5 | S8.2 48.46,12.5 | 9.14,39.17 11.89,36.42 16.15,40.69 S6.4 | X3.5 81.53,8.99 81.53,19.81 79.1,22.25 S2.4 78.94,22.4 77.27,24.08 72.85,24.08 71.17,22.4 68.89,22.4 S1.4 | 114.76,52.43 112.17,52.43 108.66,55.93 106.38,55.93 S3.4 | IC4.2 102.56,46.18 102.56,42.98 106.22,39.32 S5.4 106.38,39.32 110.95,43.89 113.54,43.89 | 48.46,12.5 50.9,12.5 v51.51,13.11
IO1_0
  Top 0.152: R28.1 72.54,27.43 72.54,25.3 72.69,25.15 C14.1 72.85,25.15 72.85,22.1 | 72.85,22.1 73,22.25 73.3,22.25 S1.2 72.85,22.1 | 72.85,22.1 61.42,10.67 46.18,10.67 46.02,10.82 46.02,16 50.29,20.27 50.29,24.99 53.34,28.04 55.47,28.04 IC5.31
IO1_1  (via drill 0.38)
  Top 0.152: 81.99,26.98 81.99,26.21 82.45,25.76 C15.1 82.6,25.6 83.52,24.69 83.52,22.4 S2.2 | 81.99,26.98 81.99,27.58 R29.1 | v61.42,38.1 58.98,35.66 58.98,30.48 56.08,27.58 55.63,27.58 IC5.32 | v82.75,31.09 80.01,28.35 80.01,27.13 80.16,26.98 81.99,26.98
  Bottom 0.152: v61.42,38.1 71.93,38.1 74.22,40.39 77.11,40.39 82.75,34.75 v82.75,31.09
IO1_2  (via drill 0.38)
  Top 0.152: 102.26,54.1 102.26,54.86 102.56,55.17 C16.1 | 102.26,54.1 102.26,52.43 R30.1 | v61.42,30.63 57.76,26.98 55.63,26.98 IC5.33 | 102.26,54.1 108.97,54.1 110.8,55.93 S3.2
  Bottom 0.152: v61.42,30.63 61.87,30.63 65.38,34.14 66.75,34.14 70.56,30.33 85.04,30.33 99.36,44.65 99.36,51.21 105.92,57.76 109.12,57.76 110.8,56.08 S3.2
IO1_3  (via drill 0.38)
  Top 0.152: v5.79,62.03 4.57,62.03 R31.1 | v52.58,26.36 55.47,26.36 IC5.34 | v24.69,54.71 24.69,61.27 21.18,64.77 15.85,64.77 15.7,64.62 15.7,63.4 16,63.09 20.57,63.09 21.64,62.03 C17.1 21.64,61.87 20.73,60.96 20.73,56.08 S4.2
  Bottom 0.152: v5.79,62.03 9.91,62.03 14.17,57.76 18.9,57.76 20.57,56.08 S4.2 | v52.58,26.36 36.58,26.36 25.45,37.49 25.45,39.78 24.69,40.54 v24.69,54.71
IO4_0  (via drill 0.38)
  Top 0.152: v60.05,33.83 60.2,33.98 63.25,33.98 IC5.17 63.4,34.14 63.86,34.14 64.01,34.29 70.1,34.29 71.17,35.36 v71.63,35.36 | v41.76,28.5 38.1,24.84 37.64,24.84 IC2.3 | v73.91,32.77 74.37,32.31 85.95,32.31 89.15,29.11 94.94,29.11 IC1.3
  Bottom 0.152: v60.05,33.83 47.09,33.83 v41.76,28.5 | X1.17 27.13,55.02 28.35,55.02 31.85,51.51 31.85,43.43 39.78,35.51 56.39,35.51 57.61,36.73 70.26,36.73 v71.63,35.36 73.91,33.07 v73.91,32.77
IO4_1  (via drill 0.38)
  Top 0.152: v60.35,35.66 61.42,34.59 63.25,34.59 IC5.18 | v39.62,28.5 39.62,27.58 38.1,26.06 37.64,26.06 IC2.4 | v71.63,33.53 85.95,33.53 89,30.48 94.94,30.48 IC1.4
  Bottom 0.152: v39.62,28.5 35.36,28.5 28.5,35.36 28.5,37.34 26.98,38.86 26.82,38.86 24.99,40.69 24.99,53.19 26.36,54.56 26.98,54.56 X1.18 27.13,54.56 28.35,54.56 31.55,51.36 31.55,43.28 39.62,35.2 56.54,35.2 57,35.66 v60.35,35.66 61.11,36.42 68.12,36.42 71.02,33.53 v71.63,33.53
IO4_2  (via drill 0.38)
  Top 0.152: v35.81,29.87 37.49,29.87 IC2.7 | IC1.7 94.94,34.29 91.59,34.29 89.76,36.12 83.67,36.12 83.52,36.27 83.52,37.03 83.82,37.34 85.95,37.34 86.26,37.64 86.26,38.41 86.11,38.56 73.91,38.56 70.26,34.9 67.82,34.9 67.51,35.2 63.4,35.2 IC5.19 63.25,35.36 v62.18,35.36
  Bottom 0.152: 35.2,34.9 35.2,30.48 v35.81,29.87 | 35.2,34.9 35.2,37.03 31.24,41 31.24,51.21 28.5,53.95 27.13,53.95 X1.19 | 35.2,34.9 61.72,34.9 v62.18,35.36
IO4_3  (via drill 0.38)
  Top 0.152: v30.02,44.35 30.48,44.35 39.47,35.36 55.47,35.36 IC5.20 55.63,35.36 v55.63,36.27 | v34.44,31.24 34.75,30.94 36.12,30.94 36.27,31.09 37.49,31.09 IC2.8 | v81.99,34.59 82.14,34.75 85.95,34.75 86.87,35.66 88.85,35.66 92.2,32.31 96.16,32.31 96.32,32.46 96.32,34.59 95.56,35.36 94.94,35.36 IC1.8
  Bottom 0.152: X1.20 27.13,53.49 28.5,53.49 30.02,51.97 v30.02,44.35 30.02,41.76 34.44,37.34 v34.44,31.24 | v81.99,34.59 78.49,34.59 76.05,37.03 56.39,37.03 v55.63,36.27
IO4_4  (via drill 0.38)
  Top 0.152: v41.6,34.14 42.06,34.59 55.47,34.59 IC5.21 | v35.97,31.7 34.9,31.7 34.59,32 28.8,32 28.04,31.24 27.58,31.24 IC2.13 | v28.5,52.58 28.5,44.5 38.1,34.9 39.01,34.9 v39.78,34.14 | v69.49,33.22 70.41,33.22 71.48,34.29 80.77,34.29 81.84,35.36 84.89,35.36 IC1.13
  Bottom 0.152: v35.97,31.7 38.41,34.14 v39.78,34.14 v41.6,34.14 42.06,34.59 66.75,34.59 68.12,33.22 v69.49,33.22 | v28.5,52.58 28.04,53.03 27.13,53.03 X1.21
IO4_5  (via drill 0.38)
  Top 0.152: v29.26,51.36 30.02,50.6 30.02,45.26 34.59,40.69 52.12,40.69 56.39,36.42 56.39,34.44 56.08,34.14 55.63,34.14 IC5.22
  Bottom 0.152: v29.26,51.36 28.8,51.36 27.74,52.43 27.13,52.43 X1.22
IO4_6  (via drill 0.38)
  Top 0.152: v29.26,50.29 29.26,44.2 29.87,43.59 30.79,43.59 39.32,35.05 39.78,35.05 41.45,33.38 55.47,33.38 IC5.23
  Bottom 0.152: v29.26,50.29 27.89,51.66 27.89,51.82 27.74,51.97 27.13,51.97 X1.23
IO4_7  (via drill 0.38)
  Top 0.152: v25.76,51.05 25.76,44.2 35.36,34.59 38.41,34.59 40.23,32.77 55.47,32.77 IC5.24
  Bottom 0.152: v25.76,51.05 26.21,51.51 26.98,51.51 X1.24
J2_1
  Top 0.152: U$3.P$3 104.09,7.92 102.72,7.92 R12.1 102.56,8.08 94.34,8.08 92.81,9.6 K2.3
J2_3
  Top 0.152: K2.10 100.43,9.6 100.74,9.3 102.56,9.3 R12.2 102.72,9.3 104.09,10.67 104.09,17.98 U$3.P$4
J3_1
  Top 0.152: 24.38,9.14 26.21,9.14 26.67,9.6 K3.3 | 24.38,9.14 22.4,11.12 22.4,17.98 U$4.P$3 | 24.38,9.14 R27.1
J3_3
  Top 0.152: 24.38,7.77 22.4,7.77 U$4.P$4 | 24.38,7.77 32.46,7.77 34.29,9.6 K3.10 | 24.38,7.77 R27.2
LD_/C  (via drill 0.38)
  Top 0.152: v30.18,27.43 33.53,24.08 38.56,24.08 43.89,29.41 55.47,29.41 IC5.29
  Bottom 0.152: v30.18,27.43 23.47,34.14 23.47,34.59 19.36,38.71 19.36,52.43 25.91,58.98 26.98,58.98 X1.9
LEDK1  (1 unrouted)
LEDK2  (1 unrouted)
LEDK3  (1 unrouted)
LEDK4  (1 unrouted)
LHVTRIG  (via drill 0.38)
  Top 0.152: v101.8,33.38 105.46,29.72 R13.1 | v95.4,42.52 v97.08,40.84 | v60.2,37.8 60.2,37.34 58.67,35.81 58.67,31.55 56.08,28.96 55.63,28.96 IC5.30
  Bottom 0.152: v101.8,33.38 101.8,36.12 v97.08,40.84 | v95.4,42.52 93.73,42.52 91.9,40.69 63.09,40.69 v60.2,37.8
LLED  (4 unrouted)
LRD  (via drill 0.38)
  Top 0.152: v59.44,27.74 61.27,27.74 62.03,28.5 62.03,28.65 62.79,29.41 63.25,29.41 IC5.10 | v27.74,37.19 27.74,41.76 24.99,44.5 24.99,54.1 25.76,54.86 v25.76,57.45
  Bottom 0.152: v59.44,27.74 35.66,27.74 27.74,35.66 v27.74,37.19 | v25.76,57.45 26.36,58.06 26.98,58.06 X1.11
LRESET  (via drill 0.38)
  Top 0.152: v34.59,30.18 35.05,30.63 35.97,30.63 36.12,30.48 38.71,30.48 39.62,31.39 55.47,31.39 IC5.26 | v32,38.86 32,40.54 27.74,44.81 27.74,59.13 v28.19,59.59
  Bottom 0.152: v34.59,30.18 32,32.77 v32,38.86 | v28.19,59.59 27.74,60.05 27.13,60.05 X1.7
LTS+
  Top 0.152: K2.8 94.03,4.57 92.51,3.05 91.14,3.05 90.22,2.13 X4.1
LTS-
  Top 0.152: K2.5 92.66,4.57 92.66,5.64 90.22,8.08 X4.3
LVSEL  (via drill 0.38)
  Top 0.152: v70.71,31.09 70.41,30.79 65.08,30.79 63.86,32 63.4,32 IC5.14 | v77.11,35.05 81.08,35.05 83.97,37.95 84.89,37.95 IC1.11
  Bottom 0.152: v70.71,31.09 73.15,31.09 v77.11,35.05
LWR  (via drill 0.38)
  Top 0.152: v64.47,28.96 63.4,28.96 IC5.9 | v66.6,32.92 68.28,32.92 69.34,33.98 70.71,33.98 71.32,34.59 71.78,34.59 74.07,36.88 v74.07,37.8 | v54.56,39.62 v74.37,39.62
  Bottom 0.152: v64.47,28.96 64.47,29.26 63.86,29.87 63.86,30.18 v66.6,32.92 | v74.07,37.8 74.07,39.32 v74.37,39.62 | v54.56,39.62 36.12,39.62 32.16,43.59 32.16,54.1 27.74,58.52 27.13,58.52 X1.10
N$1  (via drill 0.38)
  Top 0.152: v117.5,33.07 123.6,33.07 123.9,33.38 123.9,45.57 120.85,48.62 120.85,49.23 R1.1 | v98.3,28.04 95.1,28.04 94.94,27.89 IC1.2
  Bottom 0.152: v117.5,33.07 116.74,33.07 114.45,30.79 101.04,30.79 v98.3,28.04
N$2  (via drill 0.38)
  Top 0.152: v115.67,55.47 120.55,55.47 121.92,54.1 R2.1 | v88.7,34.9 89.15,34.9 92.35,31.7 94.94,31.7 IC1.5
  Bottom 0.152: v115.67,55.47 113.54,55.47 110.95,58.06 105.77,58.06 96.47,48.77 96.47,42.22 89.15,34.9 v88.7,34.9
N$3  (via drill 0.38)
  Top 0.152: v117.35,56.24 117.35,57.15 118.26,58.06 122.53,58.06 123.29,58.83 R3.1 | v93.42,33.53 94.34,33.53 94.94,32.92 IC1.6
  Bottom 0.152: v117.35,56.24 117.35,53.65 115.82,52.12 115.82,51.97 115.06,51.21 103.02,51.21 99.67,47.85 99.67,44.35 93.42,38.1 v93.42,33.53
N$4  (via drill 0.38)
  Top 0.152: v110.49,58.83 114.61,62.94 122.22,62.94 122.99,63.7 R4.1 | v92.96,39.62 92.96,38.25 94.49,36.73 94.94,36.73 IC1.9
  Bottom 0.152: v110.49,58.83 106.07,58.83 96.16,48.92 96.16,42.37 93.42,39.62 v92.96,39.62
N$5
  Top 0.152: R5.1 109.73,42.06 105.31,42.06 102.41,39.17 97.99,39.17 96.32,37.49 96.32,36.27 96.16,36.12 90.22,36.12 89.76,36.58 84.89,36.58 IC1.12
N$6  (1 unrouted)
  Top 0.152: 97.08,62.18 100.58,62.18 | 100.58,62.18 105.46,62.18 SG1.- | 100.58,62.18 L3.2
N$7  (1 unrouted)
  Top 0.152: 117.35,63.86 121.77,63.86 R4.2
N$8  (1 unrouted)
  Top 0.152: 113.54,42.67 113.08,42.22 111.25,42.22 R5.2
N$9
  Top 0.152: D2.A U$1.2 U$1.4 123.44,29.72 125.27,27.89 125.27,17.37 124.51,16.61 124.51,7.92 U$3.P$1
N$10  (1 unrouted)
  Top 0.152: 116.13,47.55 119.48,47.55 R7.1
N$11  (1 unrouted)
  Top 0.152: 117.35,52.27 120.7,52.27 R8.1
N$12  (1 unrouted)
  Top 0.152: 118.72,57.15 118.87,57 121.92,57 R9.1
N$13  (1 unrouted)
  Top 0.152: 114.91,49.38 119.48,49.38 R1.2
N$14  (1 unrouted)
  Top 0.152: 116.13,54.1 R2.2
N$15  (1 unrouted)
  Top 0.152: 117.35,58.98 121.92,58.98 R3.2
N$16  (1 unrouted)
  Top 0.152: 118.72,62.03 121.77,62.03 R10.1
N$17
  Top 0.152: IC7.7 120.4,40.08 120.4,43.13 R11.2 120.4,43.28 120.4,44.81 120.7,45.11 C1.2 120.85,45.26 120.85,47.4 R7.2 120.7,47.55 120.7,48.16 120.09,48.77 120.09,50.44 121.92,52.27 R8.2 122.07,52.43 122.07,52.88 123.29,54.1 123.29,56.84 R9.2 123.44,57 124.05,57.61 124.05,59.44 123.14,60.35 123.14,61.87 R10.2
N$18
  Top 0.152: C1.1 119.02,45.11 119.02,43.28 R11.1 118.87,43.13 118.87,41.3 118.72,41.15 118.72,38.71 119.63,37.8 121.77,37.8 123.6,35.97 123.6,33.53 123.44,33.38 120.09,33.38 119.33,34.14 119.33,34.59 IC7.1 119.18,34.75 116.89,34.75 C5.1 | 109.88,29.72 D2.C | 109.88,29.72 110.8,30.63 112.32,30.63 112.62,30.94 114.61,30.94 116.74,33.07 116.74,34.75 C5.1 | C6.1 113.84,34.9 116.74,34.9 C5.1 | 109.88,29.72 110.95,28.65 114.45,28.65 124.36,18.75 124.36,18.14 U$3.P$2
N$19
  Top 0.152: D1.A 16,29.57 13.72,29.57 13.56,29.72 U$2.2 U$2.4 3.66,29.72 2.13,28.19 2.13,18.14 U$4.P$1
N$20
  Top 0.152: R15.1 13.72,56.84 12.95,56.08 9.6,56.08 6.86,53.34 2.59,53.34 1.22,51.97 1.22,40.39 3.05,38.56 14.02,38.56 20.42,32.16 21.95,32.16 22.1,32 22.1,30.94 26.36,26.67 30.48,26.67 33.53,23.62 37.49,23.62 IC2.2
N$21
  Top 0.152: R13.2 107.44,29.72 108.66,30.94 112.17,30.94 113.23,32 U$1.1
N$22  (1 unrouted)
  Top 0.152: 95.25,60.96 R14.2
N$23
  Top 0.152: S8.1 41.91,10.97 R35.1
N$24
  Top 0.152: R16.1 13.72,51.97 13.11,51.36 10.36,51.36 10.21,51.51 7.01,51.51 5.64,50.14 5.64,49.23 5.49,49.07 3.81,49.07 3.2,48.46 3.2,47.7 1.52,46.02 1.52,40.54 3.2,38.86 15.24,38.86 18.14,35.97 21.18,35.97 23.93,33.22 23.93,31.85 25.3,30.48 33.38,30.48 34.75,29.11 36.27,29.11 36.42,29.26 38.56,29.26 38.86,28.96 38.86,28.19 38.1,27.43 37.64,27.43 IC2.5
N$25  (via drill 0.38)
  Top 0.152: v16.15,45.41 14.17,47.4 R17.1 | v22.86,31.24 24.08,31.24 26.06,29.26 34.14,29.26 34.75,28.65 37.49,28.65 IC2.6
  Bottom 0.152: v16.15,45.41 16.15,42.98 18.75,40.39 18.75,38.41 22.86,34.29 v22.86,31.24
N$26
  Top 0.152: R18.1 13.87,42.82 15.09,41.6 15.09,39.47 18.29,36.27 23.16,36.27 26.36,33.07 28.5,33.07 29.11,32.46 37.49,32.46 IC2.9
N$27
  Top 0.152: R19.1 24.54,32.46 27.43,32.46 IC2.12
N$28  (1 unrouted)
N$29  (1 unrouted)
  Top 0.152: 8.69,57 12.5,57 R15.2
N$30  (1 unrouted)
  Top 0.152: 8.69,52.43 8.99,52.12 12.5,52.12 R16.2
N$31  (1 unrouted)
  Top 0.152: 8.99,47.85 9.3,47.55 12.8,47.55 R17.2
N$32  (1 unrouted)
  Top 0.152: R18.2 11.89,43.43 10.52,42.06
N$33  (via drill 0.38)  (1 unrouted)
  Top 0.152: v22.1,32.92 22.4,32.61 23.16,32.61 R19.2
  Bottom 0.152: v22.1,32.92 21.64,32.92 21.18,32.46 15.09,32.46 13.26,34.29 10.67,34.29
N$34  (via drill 0.38)
  Top 0.152: v35.66,10.97 40.39,10.97 R35.2 | K2.1 92.66,14.63 89,14.63 80.92,6.55 43.74,6.55 40.69,9.6 35.66,9.6 30.63,14.63 26.67,14.63 K3.1
  Bottom 0.152: v35.66,10.97 30.33,10.97 26.67,14.63 K3.1
N$35  (1 unrouted)
  Top 0.152: 9.91,55.17 12.5,55.17 R22.1
N$36  (1 unrouted)
  Top 0.152: R23.1 10.06,50.29 9.91,50.44
N$37  (1 unrouted)
  Top 0.152: 10.21,46.02 12.8,46.02 R24.1
N$38  (1 unrouted)
  Top 0.152: 11.73,40.23 11.89,40.39 13.72,40.39 R25.1
N$39
  Top 0.152: R26.2 2.29,44.2 4.27,44.2 4.57,43.89 C2.2 4.57,43.74 | 4.57,43.74 4.57,41.91 3.96,41.3 IC8.7 | R25.2 13.72,42.37 13.26,42.82 13.26,44.2 | 13.26,44.2 13.26,45.11 14.02,45.87 R24.2 14.02,46.02 13.41,46.63 13.41,48.01 13.72,48.31 13.72,50.29 R23.2 14.48,50.9 14.48,52.58 13.87,53.19 13.87,55.02 R22.2 | 4.57,43.74 11.73,43.74 12.19,44.2 13.26,44.2
N$40  (via drill 0.38)
  Top 0.152: C8.1 21.03,31.24 18.9,31.24 C7.1 18.75,31.24 18.14,31.85 16,31.85 D1.C 16,32 12.95,35.05 12.95,36.58 11.73,37.8 v3.96,37.8 2.74,36.58 2.74,36.12 IC8.1 2.74,35.97 2.9,35.81 v2.9,34.14 | R26.1 2.29,45.72 4.57,45.72 C2.1 4.57,45.57 4.88,45.57 v5.94,44.5
  Bottom 0.152: v5.94,44.5 5.94,39.78 v3.96,37.8 | v2.9,34.14 2.9,17.37 2.13,16.61 2.13,7.92 U$4.P$2
N$41  (1 unrouted)
N$42
  Top 0.152: U$2.1 14.48,27.43 23.16,18.75 26.98,18.75 35.81,9.91 42.37,9.91 42.52,10.06 49.53,10.06 49.99,9.6 69.49,9.6 74.37,14.48 74.37,26.98 71.32,30.02 71.02,30.02 69.95,28.96 69.95,25.3 69.49,24.84 69.19,24.84 67.82,23.47 67.82,23.32 66.6,22.1 66.14,22.1 R21.2
N$43  (1 unrouted)
N$44  (1 unrouted)
N$45  (1 unrouted)
  Top 0.152: 113.54,41.3 114.15,41.3 117.96,37.49 120.85,37.49 122.99,35.36 122.99,34.75 IC7.4
N$46  (1 unrouted)
N$47  (1 unrouted)
  Top 0.152: 9.3,36.27 9.14,36.12 6.55,36.12 IC8.4
N$48  (1 unrouted)
N$49  (1 unrouted)
N$50  (1 unrouted)
RHVTRIG
  Top 0.152: R21.1 65.99,23.32 65.38,23.32 63.86,24.84 63.4,24.84 IC5.3
RTS+
  Top 0.152: K3.8 38.1,4.57 40.54,2.13 X5.1
RTS-
  Top 0.152: K3.5 32.92,4.57 35.81,7.47 39.93,7.47 40.54,8.08 X5.3
RVSEL
  Top 0.152: IC5.25 55.47,32.16 39.47,32.16 38.56,33.07 28.96,33.07 28.5,33.53 27.58,33.53 IC2.11
SCL  (via drill 0.38)
  Top 0.152: v64.62,30.02 64.62,30.48 63.7,31.39 63.4,31.39 IC5.13 | 77.57,8.53 v77.57,9.75 | 77.57,8.53 78.33,7.77 79.1,7.77 X3.2 | 77.57,8.53 75.89,6.86 47.4,6.86 46.63,7.62 46.33,7.62 X2.2
  Bottom 0.152: v64.62,30.02 64.62,29.72 67.82,26.52 67.82,21.03 68.43,20.42 77.57,20.42 78.79,19.2 78.79,17.83 77.57,16.61 v77.57,9.75
SDA  (via drill 0.38)
  Top 0.152: v67.97,35.66 67.21,36.42 60.2,36.42 59.28,35.51 59.28,33.68 62.18,30.79 63.25,30.79 IC5.12 | v71.78,31.85 71.78,30.02 76.66,25.15 76.66,12.34 | 76.66,12.34 80.01,8.99 X3.3 | 76.66,12.34 73.61,9.3 49.84,9.3 49.38,9.75 48.16,9.75 47.4,8.99 47.09,8.99 X2.3
  Bottom 0.152: v71.78,31.85 v67.97,35.66
SPKR  (via drill 0.38)
  Top 0.152: R14.1 95.25,43.28 94.64,42.67 94.64,40.54 v95.71,39.47 | v77.42,19.66 v83.21,19.66 | v64.16,19.66 60.81,19.66 60.66,19.51 59.89,19.51 59.74,19.66 v59.74,24.38 | v61.27,28.65 62.64,30.02 63.25,30.02 IC5.11
  Bottom 0.152: v95.71,39.47 95.71,32.16 v83.21,19.66 | v64.16,19.66 v77.42,19.66 | v59.74,24.38 59.74,27.13 v61.27,28.65
TCK  (via drill 0.38)
  Top 0.152: R32.1 102.56,50.44 102.56,48.01 104.85,45.72 C18.1 105,45.57 107.59,45.57 110.49,42.67 110.49,41.6 110.8,41.3 110.8,39.32 S5.2 | v1.22,57.61 TP4.TP | v51.51,19.05 51.97,19.05 56.08,23.16 56.24,23.16 56.39,23.32 56.39,25.15 56.08,25.45 55.63,25.45 IC5.35 | v78.03,18.9 v88.24,18.9
  Bottom 0.152: v1.22,57.61 1.22,36.73 33.22,4.72 33.22,1.68 33.83,1.07 36.12,1.07 41.91,6.86 48.16,6.86 52.27,10.97 52.27,13.87 51.51,14.63 v51.51,19.05 57.61,19.05 59.74,21.18 61.72,21.18 64.01,18.9 v78.03,18.9 | v88.24,18.9 108.51,39.17 110.8,39.17 S5.2
TDI  (via drill 0.38)
  Top 0.152: v3.5,61.42 2.59,61.42 TP2.TP | v21.49,46.33 v18.59,49.23 | v58.83,21.64 58.98,21.49 58.98,20.42 R34.1 | IC5.37 55.47,24.38 53.8,24.38 52.58,23.16 52.58,22.4 S7.2 | v57.3,21.64 56.54,20.88 55.93,20.88 C20.1
  Bottom 0.152: v3.5,61.42 5.49,61.42 8.99,57.91 9.91,57.91 v18.59,49.23 | v21.49,46.33 21.49,42.22 25.15,38.56 25.15,37.34 36.88,25.6 52.88,25.6 54.71,23.77 54.71,23.47 | 54.71,23.47 53.65,22.4 52.58,22.4 S7.2 | v58.83,21.64 v57.3,21.64 56.54,21.64 54.71,23.47
TDO  (via drill 0.38)
  Top 0.152: v53.95,23.62 55.47,23.62 IC5.38 | v1.83,62.03 TP1.TP | R36.1 26.52,19.66 v25.76,20.42 25.76,22.25 26.36,22.86 29.57,22.86 33.07,19.36 34.59,19.36 C21.1 34.75,19.36 v36.12,20.73
  Bottom 0.152: v53.95,23.62 53.49,23.62 53.03,24.08 44.35,24.08 41.91,21.64 S8.3 41.91,21.49 36.88,21.49 v36.12,20.73 | v1.83,62.03 1.83,57.91 1.98,57.76 1.98,38.86 12.34,28.5 17.68,28.5 v25.76,20.42
TEST  (via drill 0.38)
  Top 0.152: TP6.TP v3.96,56.39 4.72,57.15 R20.1 | v61.57,20.42 63.25,22.1 63.25,23.47 IC5.1 | v42.06,6.1 39.78,6.1 v39.17,6.71
  Bottom 0.152: v61.57,20.42 61.57,19.81 47.85,6.1 v42.06,6.1 | v39.17,6.71 36.42,9.45 36.42,11.12 16.61,30.94 12.5,30.94 6.71,36.73 6.71,49.84 3.96,52.58 v3.96,56.39
TMS  (via drill 0.38)
  Top 0.152: v3.5,60.2 TP3.TP | v17.22,47.09 18.29,46.02 R33.1 18.44,45.87 18.9,45.41 18.9,43.74 C19.1 19.05,43.59 19.05,42.37 20.57,40.84 S6.2 | v51.05,24.84 55.47,24.84 IC5.36
  Bottom 0.152: v3.5,60.2 7.62,56.08 7.77,56.08 8.99,54.86 8.99,54.41 16.31,47.09 v17.22,47.09 | v51.05,24.84 36.58,24.84 20.73,40.69 S6.2
VCC  (via drill 0.38)
  Top 0.152: K3.12 34.29,14.63 37.95,14.63 41.15,11.43 41.15,10.36 41.3,10.21 42.22,10.21 43.43,11.43 R6.2 45.41,11.43 45.41,10.97 46.02,10.36 v69.34,10.36 | v21.95,38.56 23.01,39.62 23.01,62.48 21.64,63.86 16.76,63.86 IC3.3 | L3.1 100.58,59.89 109.58,59.89 111.86,62.18 SG1.+ | C10.1 97.38,26.67 v97.08,26.36
  Bottom 0.152: v21.95,38.56 21.95,37.95 34.29,25.6 K3.12 34.29,14.63 35.66,14.63 41.3,8.99 41.76,8.99 | 41.76,8.99 45.26,8.99 X2.1 | K3.7 34.29,2.44 37.8,5.94 40.08,5.94 41.76,7.62 41.76,8.99 | 96.77,5.64 80.01,5.64 78.33,7.32 78.33,8.84 X3.1 78.33,8.99 77.42,8.99 76.05,10.36 v69.34,10.36 | 96.77,5.64 100.28,2.13 K2.7 | 96.77,5.64 96.77,7.47 100.28,10.97 100.28,14.63 K2.12 97.08,17.98 v97.08,26.36 97.54,26.36 99.67,28.5 114.45,28.5 118.26,32.31 118.26,56.24 112.32,62.18 112.01,62.18 SG1.+
XIN
  Top 0.152: IC5.6 63.4,26.82 65.84,26.82 65.99,26.98 Q3.2 66.14,27.13 66.14,29.72 C12.1
XOUT
  Top 0.152: IC5.5 63.4,26.21 65.23,26.21 65.99,25.45 Q3.1 66.14,25.45 66.29,25.6 68.58,25.6 C11.1
(copper drawn outside any net)
  shapes: Bottom area x1, Top area x1